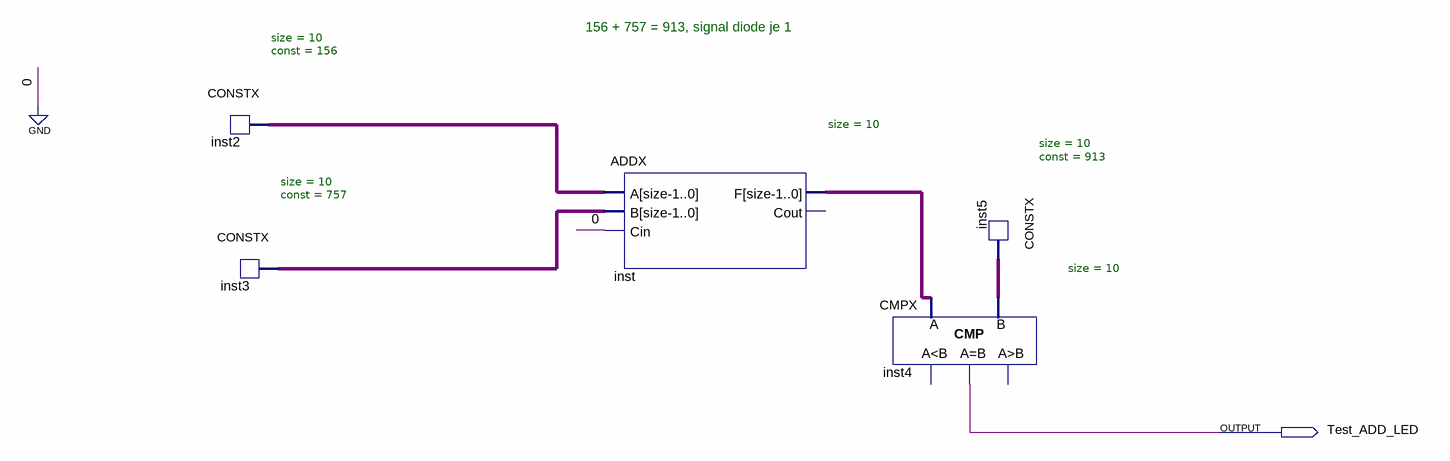
[diagram p0: schematic sheet]
// Quartus schematic Test_ADD.bdf as structural Verilog: 5 symbols, 1 pins
module Test_ADD (
  output Test_ADD_LED
);

  wire [9:0] inst2_data, inst3_data, inst5_data, inst_f;

  CONSTX #(.size(10), .\const (156)) inst2 (.data(inst2_data));
  CONSTX #(.size(10), .\const (757)) inst3 (.data(inst3_data));
  ADDX #(.size(10)) inst (.A(inst2_data), .B(inst3_data), .Cin(1'b0), .F(inst_f));  // open: Cout
  CMPX #(.size(10)) inst4 (.A(inst_f), .B(inst5_data), .eq(Test_ADD_LED));  // open: ls, gr
  CONSTX #(.size(10), .\const (913)) inst5 (.data(inst5_data));

  // Notes on the sheet:
  //   156 + 757 = 913, signal diode je 1
endmodule
